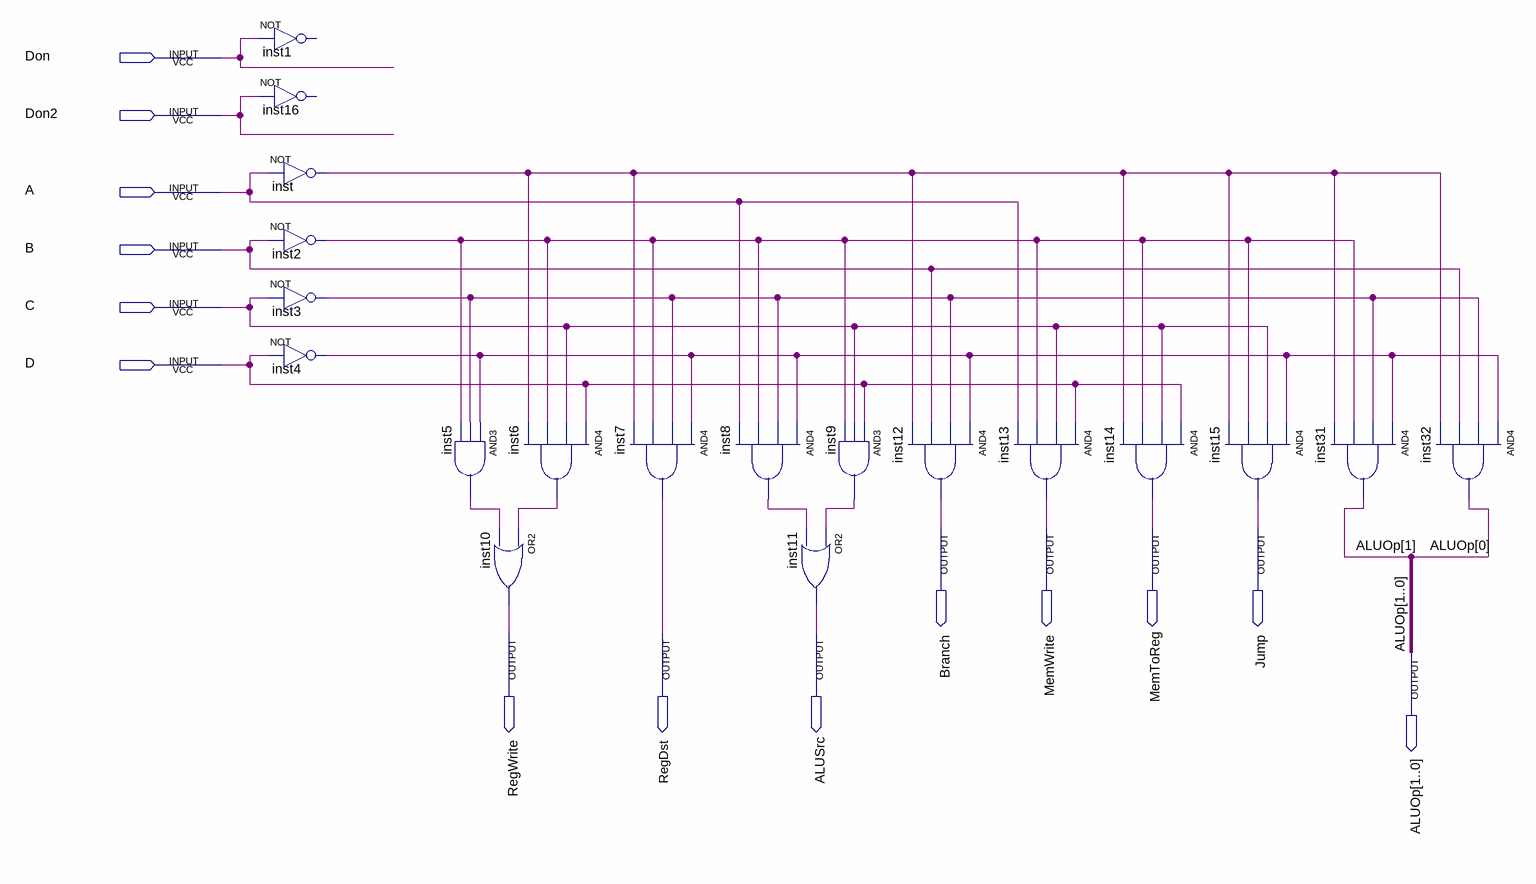
[diagram p0: schematic sheet]
// Quartus schematic maindecoder.bdf as structural Verilog: 19 symbols, 14 pins
module maindecoder (
  input  Don,
  input  Don2,
  input  A,
  input  B,
  input  C,
  input  D,
  output Branch,
  output MemWrite,
  output MemToReg,
  output Jump,
  output RegWrite,
  output RegDst,
  output ALUSrc,
  output [1:0] ALUOp
);

  wire inst2_out, inst3_out, inst4_out, inst5_out, inst6_out, inst8_out, inst9_out, inst_out;

  // NOT inst1 has open pins: IN=Don, OUT=open
  // NOT inst16 has open pins: IN=Don2, OUT=open
  not inst (inst_out, A);
  not inst2 (inst2_out, B);
  not inst3 (inst3_out, C);
  not inst4 (inst4_out, D);
  and inst5 (inst5_out, inst4_out, inst3_out, inst2_out);
  or inst10 (RegWrite, inst6_out, inst5_out);
  and inst6 (inst6_out, D, C, inst2_out, inst_out);
  and inst7 (RegDst, inst4_out, inst3_out, inst2_out, inst_out);
  and inst8 (inst8_out, inst4_out, inst3_out, inst2_out, A);
  or inst11 (ALUSrc, inst9_out, inst8_out);
  and inst9 (inst9_out, D, C, inst2_out);
  and inst12 (Branch, inst4_out, inst3_out, B, inst_out);
  and inst13 (MemWrite, D, C, inst2_out, A);
  and inst14 (MemToReg, D, C, inst2_out, inst_out);
  and inst15 (Jump, inst4_out, C, inst2_out, inst_out);
  and inst31 (ALUOp[1], inst4_out, inst3_out, inst2_out, inst_out);
  and inst32 (ALUOp[0], inst4_out, inst3_out, B, inst_out);
endmodule
